# Altium schematic sheet CH570Q-UART-R0.SchDoc
size 199 x 100 mm
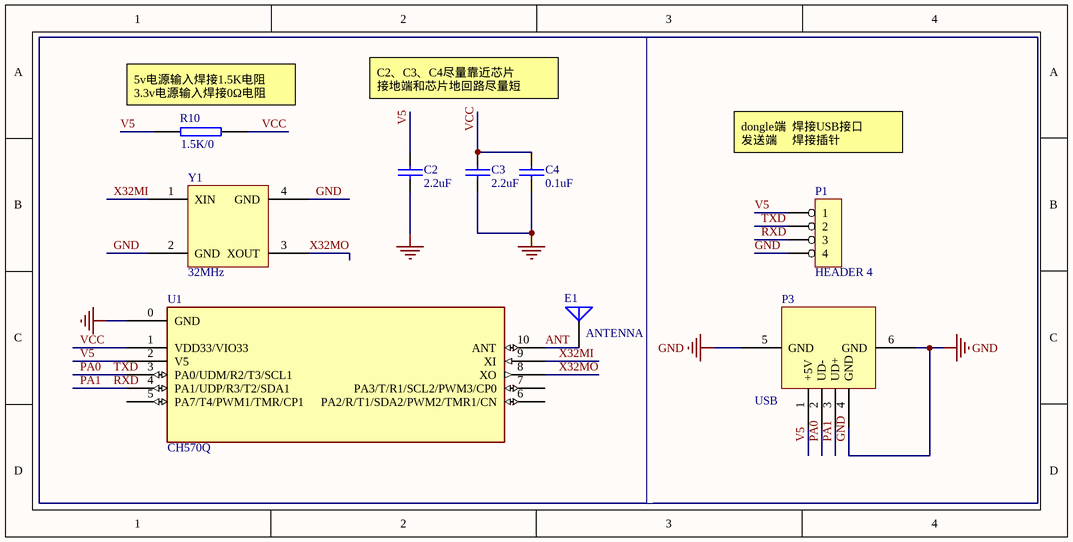
[diagram p0: CH570Q-UART-R0.SchDoc]

## Parts
C2  2.2uF  [0402_C]
C3  2.2uF  [0402_C]
C4  0.1uF  [0402_C]
E1  ANTENNA  [ANT-F-1-2.4G-0.8mmFR4]
P1  HEADER 4  [SIP4-2.54mm]
P3  USB  [USBAM-4P]
R10  1.5K/0  [0402]
U1  CH570Q  [DFN10_3X3]
Y1  32MHz  [XT2016]

## Nets
GND: C2.2 C3.2 C4.2 P1.4 P3.4(GND) P3.5(GND) P3.6(GND) U1.0(GND) Y1.2(GND) Y1.4(GND)
ANT: E1.1(A) U1.10(ANT)
PA0: P1.2 P3.2(UD-) U1.3(PA0/UDM/R2/T3/SCL1)  [also labelled TXD]
PA1: P1.3 P3.3(UD+) U1.4(PA1/UDP/R3/T2/SDA1)  [also labelled RXD]
V5: C2.1 P1.1 P3.1(+5V) R10.1 U1.2(V5)
VCC: C3.1 C4.1 R10.2 U1.1(VDD33/VIO33)
X32MI: U1.9(XI) Y1.1(XIN)
X32MO: U1.8(XO) Y1.3(XOUT)

Not connected (* = marked no-connect by the designer): U1 5(PA7/T4/PWM1/TMR/CP1) 6(PA2/R/T1/SDA2/PWM2/TMR1/CN) 7(PA3/T/R1/SCL2/PWM3/CP0)

## Notes on the sheet
- (near R10) 5v电源输入焊接1.5K电阻
  3.3v电源输入焊接0Ω电阻
- C2、C3、C4尽量靠近芯片
  接地端和芯片地回路尽量短
- dongle端  焊接USB接口
  发送端     焊接插针

## Library data of the parts
C2-C4 = CAP: Capacitor
E1 = ANTENNA: Generic Antenna
P1 = HEADER 4: Header, 4-Pin
R10 = RES2
U1 = CH570Q: RISC-V MCU with BLE/2.4GHz Wireless/USB/UART/I2C/PWM/CMP
Y1 = 晶体